# Altium schematic sheet Power_suply.SchDoc
size A4; SheetNumber: 5; SheetTotal: 6
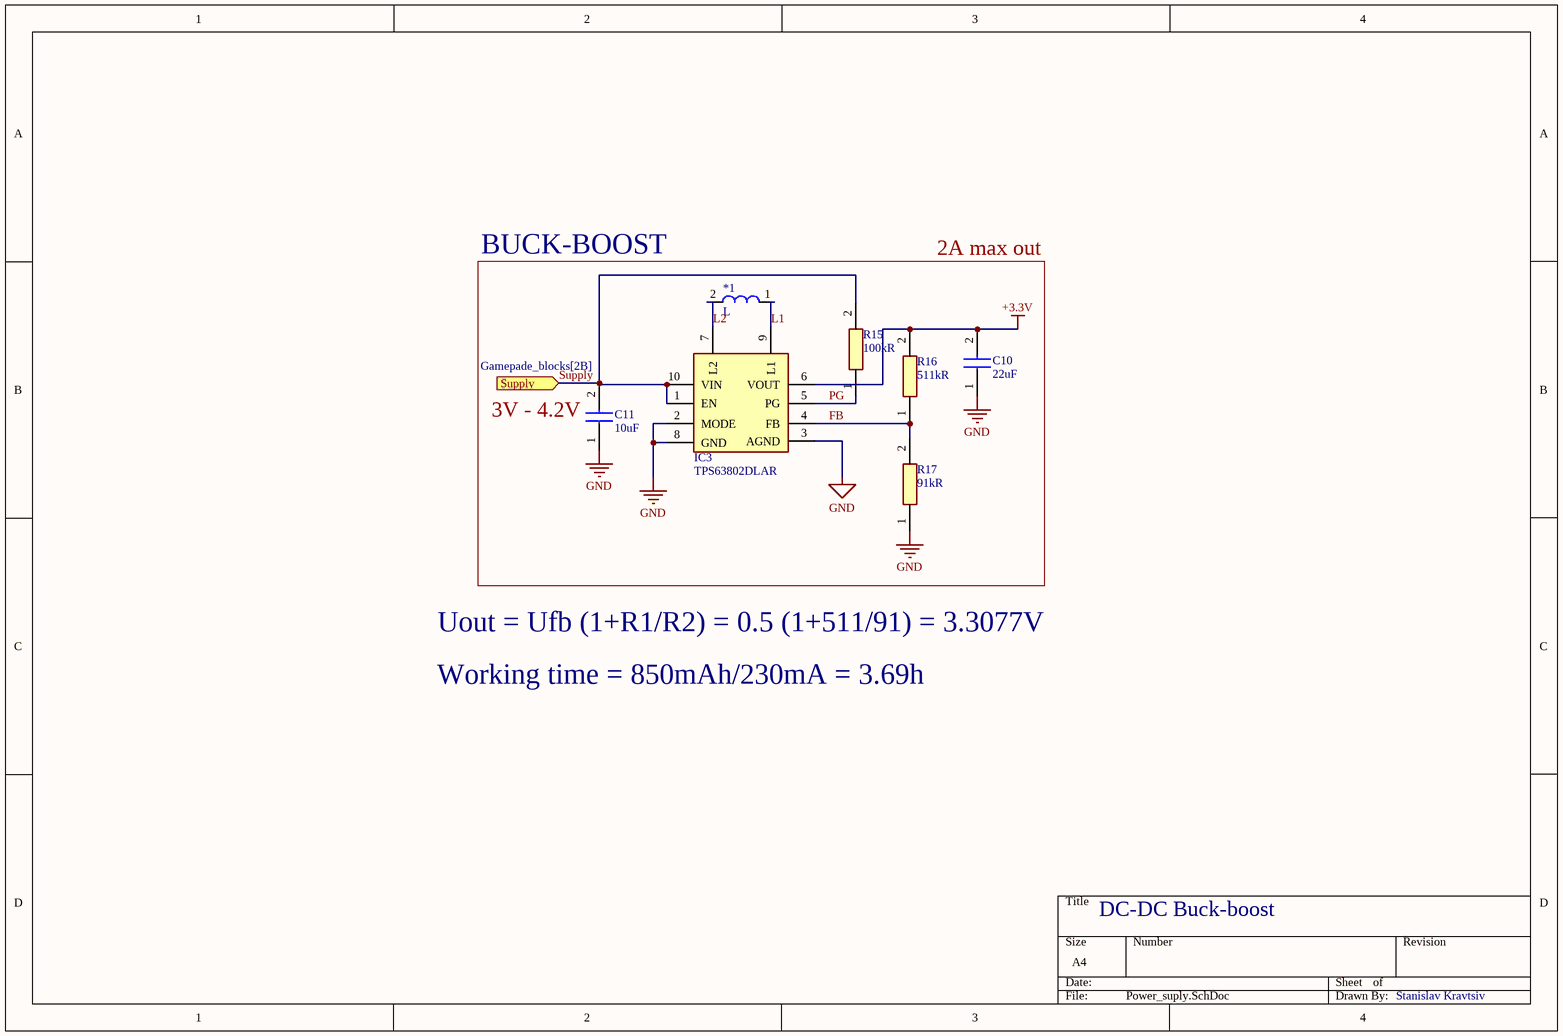
[diagram p0: Power_suply.SchDoc]

## Parts
*1  L  [Coil]
C10  22uF  [ZRB18x]
C11  10uF  [CAPC2012X140N]
IC3  TPS63802DLAR  [TPS63802DLAR]
R15  100kR  [RESC1608X55N]
R16  511kR  [RESC1608X55N]
R17  91kR  [RESC1608X55N]

## Ports
Supply (in, see Gamepade_blocks[2B])

## Nets
+3.3V: C10.2 IC3.6(VOUT) R16.2
GND: C10.1 C11.1 IC3.2(MODE) IC3.3(AGND) IC3.8(GND) R17.1
FB: IC3.4(FB) R16.1 R17.2
L1: *1.1 IC3.9(L1)
L2: *1.2 IC3.7(L2)
PG: IC3.5(PG) R15.1
Supply: C11.2 IC3.1(EN) IC3.10(VIN) R15.2 ; port Supply

## Notes on the sheet
- BUCK-BOOST
- 2A max out
- (near C11) 3V - 4.2V
- Uout = Ufb (1+R1/R2) = 0.5 (1+511/91) = 3.3077V
- Working time = 850mAh/230mA = 3.69h
- DC-DC Buck-boost
- Stanislav Kravtsiv

## Library data of the parts
C10 = ZRB18AR61A226ME01L: Capacitor; Manufacturer_Name: Murata Electronics; Datasheet Link: https://search.murata.co.jp/Ceramy/image/img/A01X/G101/ENG/ZRB18AR61A226ME01-03A.pdf; Height: 1.2mm; Manufacturer_Part_Number: ZRB18AR61A226ME01L; Mouser Part Number: 81-ZRB18AR61A226ME1L; Mouser Price/Stock: https://www.mouser.co.uk/ProductDetail/Murata-Electronics/ZRB18AR61A226ME01L?qs=5aG0NVq1C4zcCU98as8CPQ%3D%3D; Arrow Part Number: ZRB18AR61A226ME01L; Arrow Price/Stock: https://www.arrow.com/en/products/zrb18ar61a226me01l/murata-manufacturing?region=nac
C11 = CL21B106KPQNNNG: Capacitor; Manufacturer_Name: SAMSUNG; Datasheet Link: https://datasheet.datasheetarchive.com/originals/distributors/Datasheets-DGA8/2485630.pdf; Height: 1.4mm; Manufacturer_Part_Number: CL21B106KPQNNNG; Mouser Part Number: 187-CL21B106KPQNNNG; Mouser Price/Stock: https://www.mouser.co.uk/ProductDetail/Samsung-Electro-Mechanics/CL21B106KPQNNNG?qs=yOVawPpwOwmi1gAJqK4H6Q%3D%3D; Arrow Part Number: CL21B106KPQNNNG; Arrow Price/Stock: https://www.arrow.com/en/products/cl21b106kpqnnng/samsung-electro-mechanics?utm_currency=USD&region=nac
IC3 = TPS63802DLAR: Integrated Circuit; Manufacturer_Name: Texas Instruments; Datasheet Link: http://www.ti.com/lit/ds/symlink/tps63802.pdf; Height: 1mm; Manufacturer_Part_Number: TPS63802DLAR; Mouser Part Number: 595-TPS63802DLAR; Mouser Price/Stock: https://www.mouser.co.uk/ProductDetail/Texas-Instruments/TPS63802DLAR?qs=9r4v7xj2Lnmr2ylyTiX9Mg%3D%3D; Arrow Part Number: TPS63802DLAR; Arrow Price/Stock: https://www.arrow.com/en/products/tps63802dlar/texas-instruments?utm_currency=USD&region=nac
R15 = RC0603FR-07100KL: Resistor; Manufacturer_Name: YAGEO; Datasheet Link: https://www.yageo.com/upload/media/product/productsearch/datasheet/rchip/PYu-RC_Group_51_RoHS_L_12.pdf; Height: 0.55mm; Manufacturer_Part_Number: RC0603FR-07100KL; Mouser Part Number: 603-RC0603FR-07100KL; Mouser Price/Stock: https://www.mouser.co.uk/ProductDetail/YAGEO/RC0603FR-07100KL?qs=e1ok2LiJcmaihem8Va5%2Fsw%3D%3D; Arrow Part Number: RC0603FR-07100KL; Arrow Price/Stock: https://www.arrow.com/en/products/rc0603fr-07100kl/yageo?utm_currency=USD&region=europe
R16 = ERJ-3EKF5113V: Resistor; Manufacturer_Name: Panasonic; Datasheet Link: http://industrial.panasonic.com/cdbs/www-data/pdf/RDA0000/AOA0000C86.pdf; Height: 0.55mm; Manufacturer_Part_Number: ERJ-3EKF5113V; Mouser Part Number: 667-ERJ-3EKF5113V; Mouser Price/Stock: https://www.mouser.co.uk/ProductDetail/Panasonic/ERJ-3EKF5113V?qs=MVjVSMjNRMp7W4j9eXihvA%3D%3D
R17 = ERJ-3EKF9102V: Resistor; Manufacturer_Name: Panasonic; Datasheet Link: http://industrial.panasonic.com/cdbs/www-data/pdf/RDA0000/AOA0000C86.pdf; Height: 0.55mm; Manufacturer_Part_Number: ERJ-3EKF9102V; Mouser Part Number: 667-ERJ-3EKF9102V; Mouser Price/Stock: https://www.mouser.co.uk/ProductDetail/Panasonic/ERJ-3EKF9102V?qs=iBwFsHVUAOc4tH39HZ1qJA%3D%3D; Arrow Part Number: ERJ-3EKF9102V; Arrow Price/Stock: https://www.arrow.com/en/products/erj-3ekf9102v/panasonic?region=nac